# EAGLE design ram (EAGLE 9.5.0)
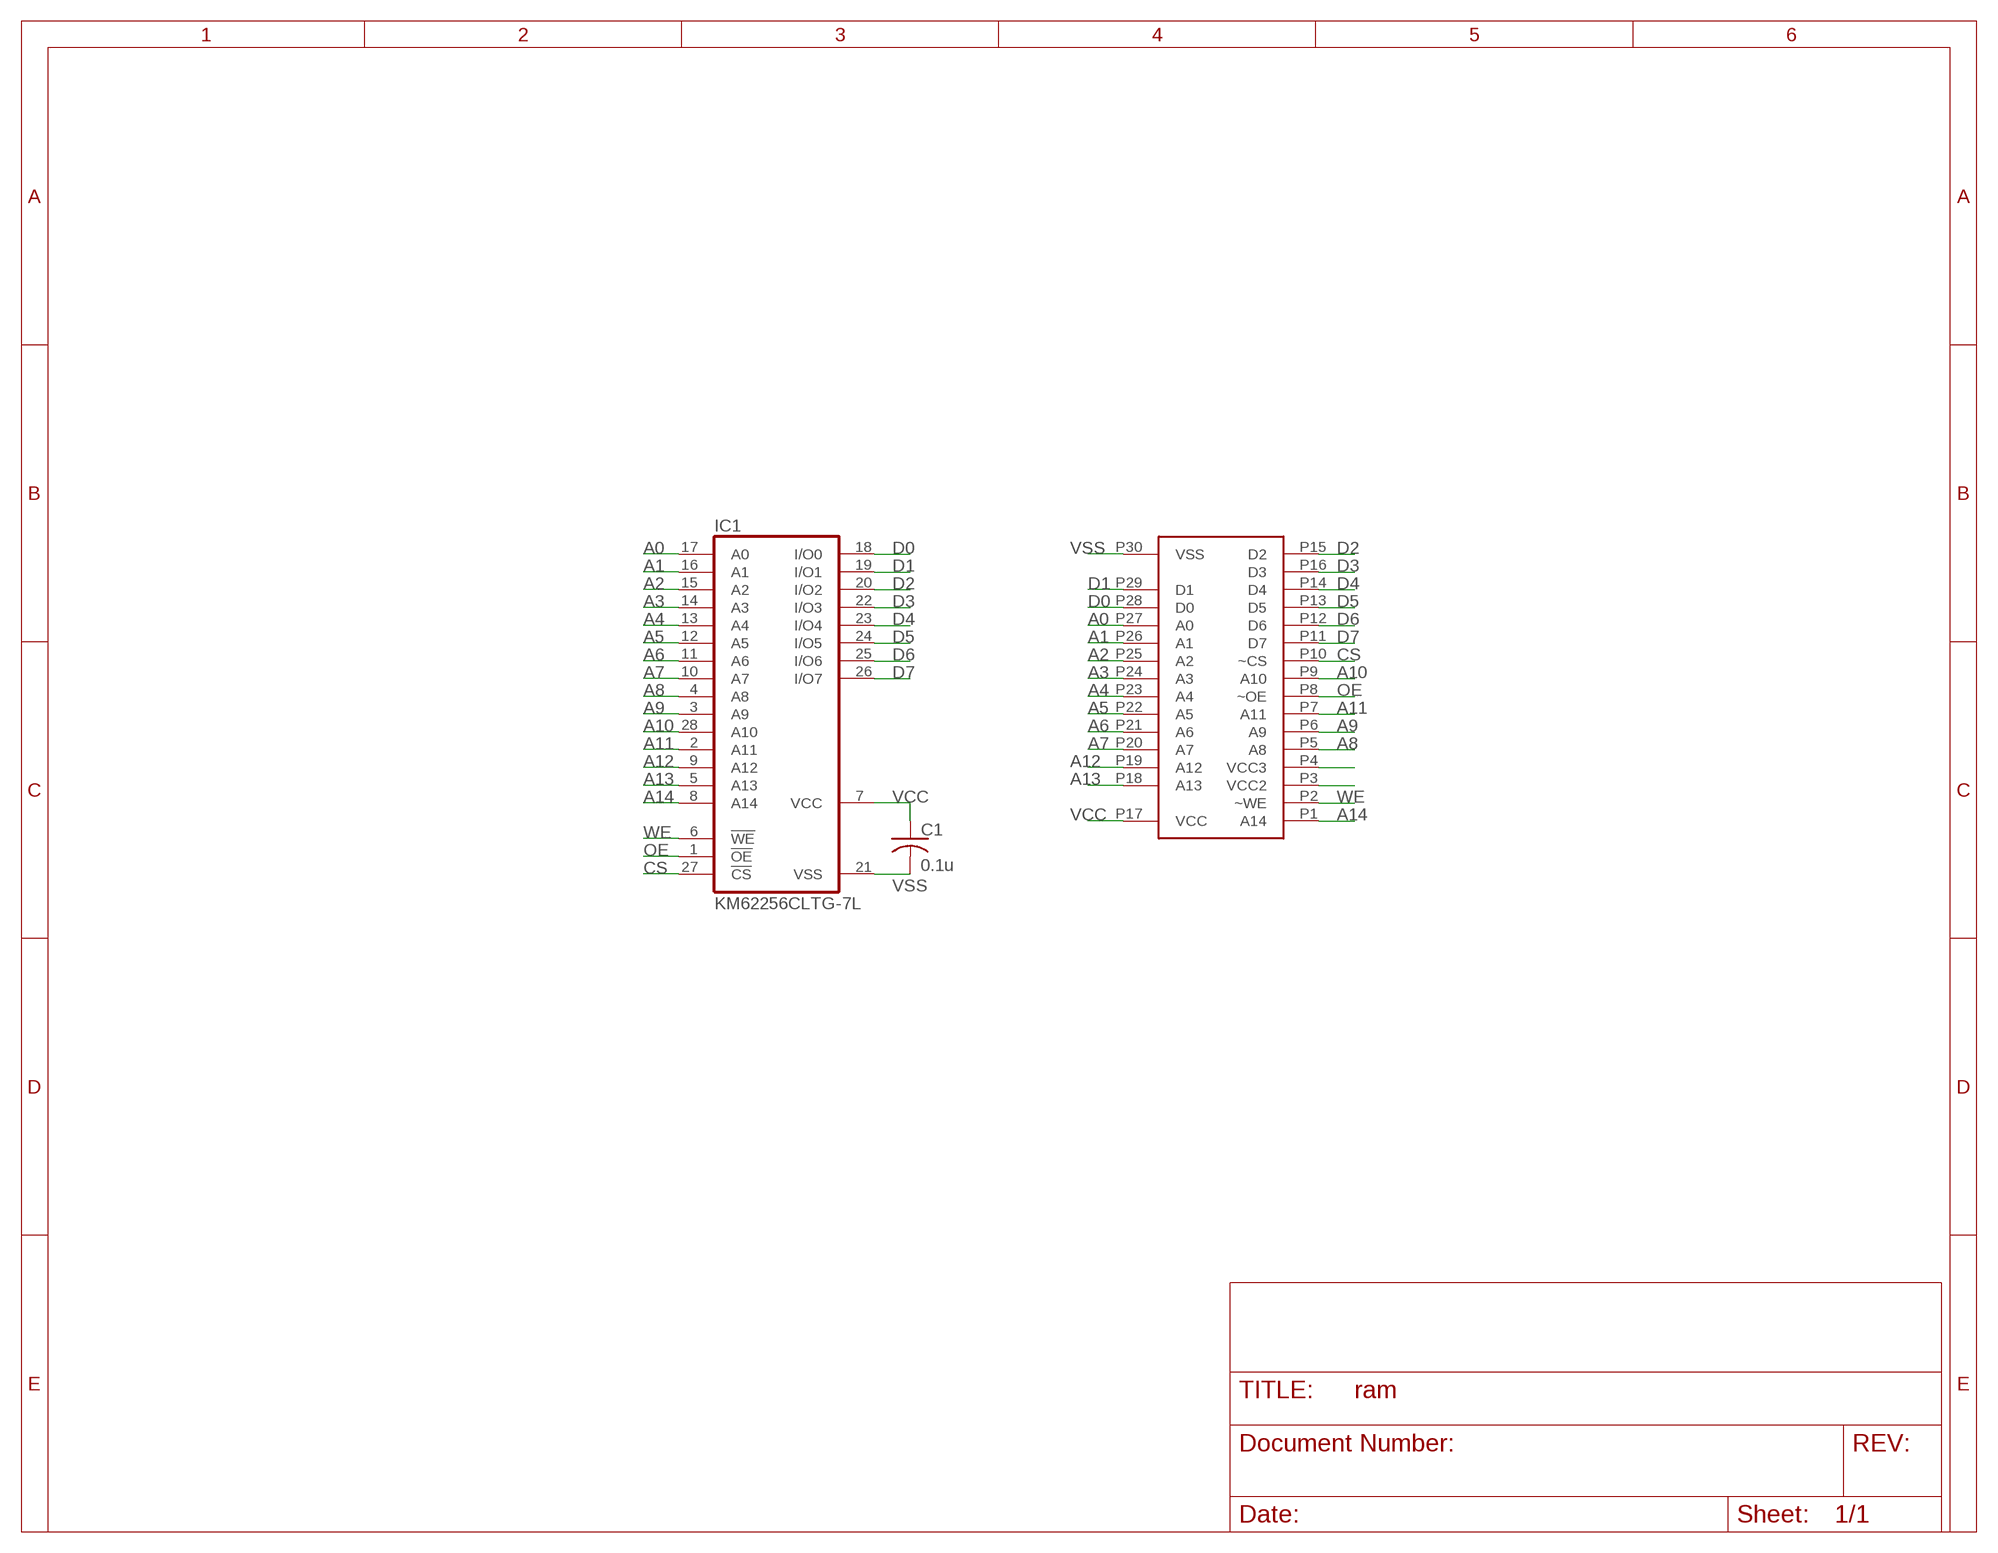
[diagram p0: schematic, sheet 1]

## Parts
C1  0.1u  C-USC0603  [C0603]
IC1  KM62256CLTG-7L  KM62256CLTG-7L_TSOP28F  [TSOP1-28]
U$1  RAMPORT  [CASIORAM]

## Nets
A0: IC1.17(A0) U$1.P27(A0)
A1: IC1.16(A1) U$1.P26(A1)
A2: IC1.15(A2) U$1.P25(A2)
A3: IC1.14(A3) U$1.P24(A3)
A4: IC1.13(A4) U$1.P23(A4)
A5: IC1.12(A5) U$1.P22(A5)
A6: IC1.11(A6) U$1.P21(A6)
A7: IC1.10(A7) U$1.P20(A7)
A8: IC1.4(A8) U$1.P5(A8)
A9: IC1.3(A9) U$1.P6(A9)
A10: IC1.28(A10) U$1.P9(A10)
A11: IC1.2(A11) U$1.P7(A11)
A12: IC1.9(A12) U$1.P19(A12)
A13: IC1.5(A13) U$1.P18(A13)
A14: IC1.8(A14) U$1.P1(A14)
CS: IC1.27(!CS) U$1.P10(~CS)
D0: IC1.18(I/O0) U$1.P28(D0)
D1: IC1.19(I/O1) U$1.P29(D1)
D2: IC1.20(I/O2) U$1.P15(D2)
D3: IC1.22(I/O3) U$1.P16(D3)
D4: IC1.23(I/O4) U$1.P14(D4)
D5: IC1.24(I/O5) U$1.P13(D5)
D6: IC1.25(I/O6) U$1.P12(D6)
D7: IC1.26(I/O7) U$1.P11(D7)
N$1: U$1.P4(VCC3)
N$2: U$1.P3(VCC2)
OE: IC1.1(!OE) U$1.P8(~OE)
VCC: C1.1 IC1.7(VCC) U$1.P17(VCC)
VSS: C1.2 IC1.21(VSS) U$1.P30(VSS)
WE: IC1.6(!WE) U$1.P2(~WE)

## Library data of the parts
C1 = rcl:C-US: CAPACITOR, American symbol; SPICEPREFIX: C
IC1 = memory-hitachi-hb:KM62256C: MEMORY
U$1 = RAM:RAMPORT

## Board
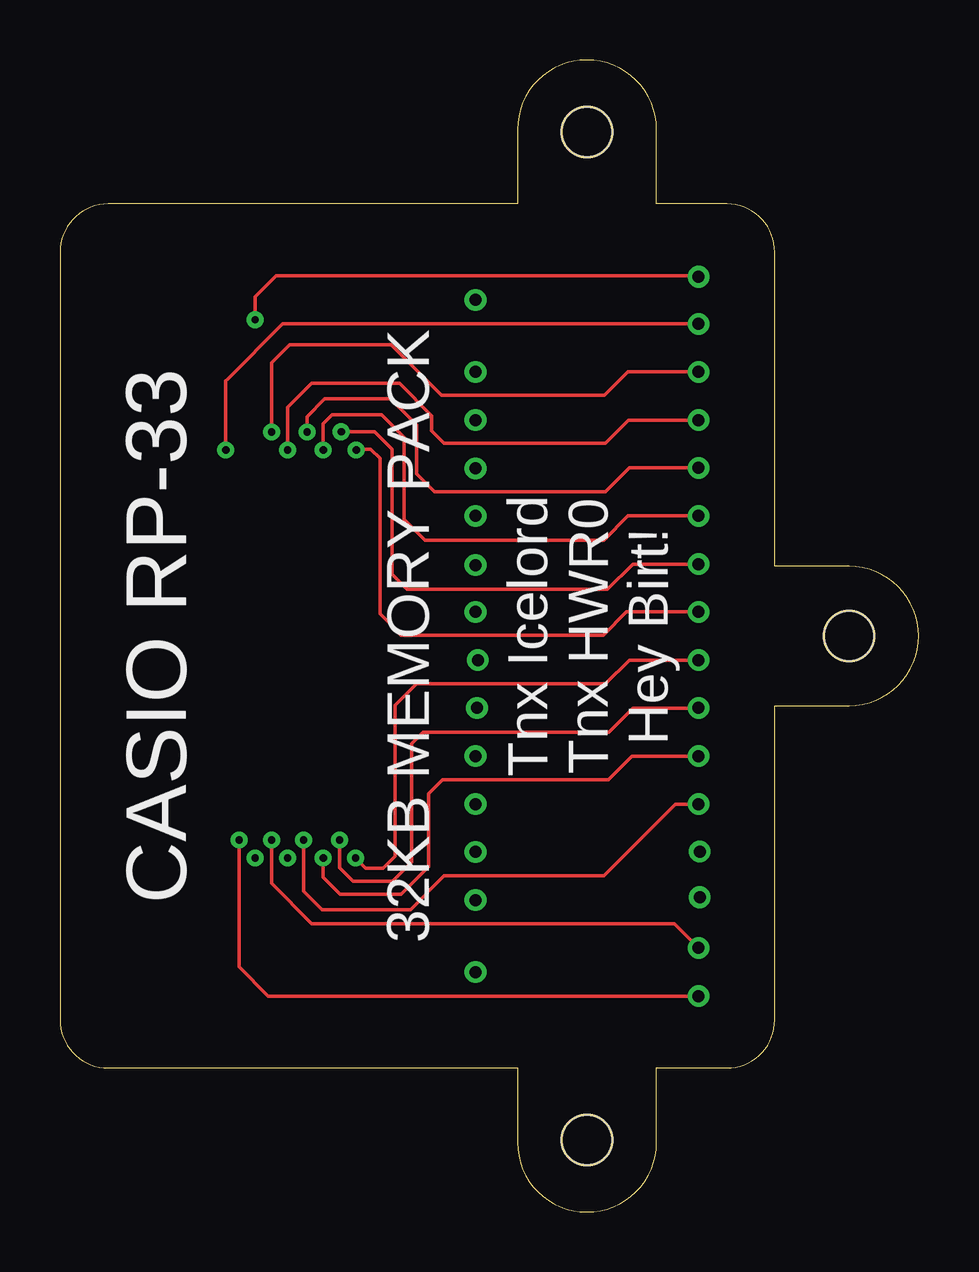
[diagram p1: board, top side]
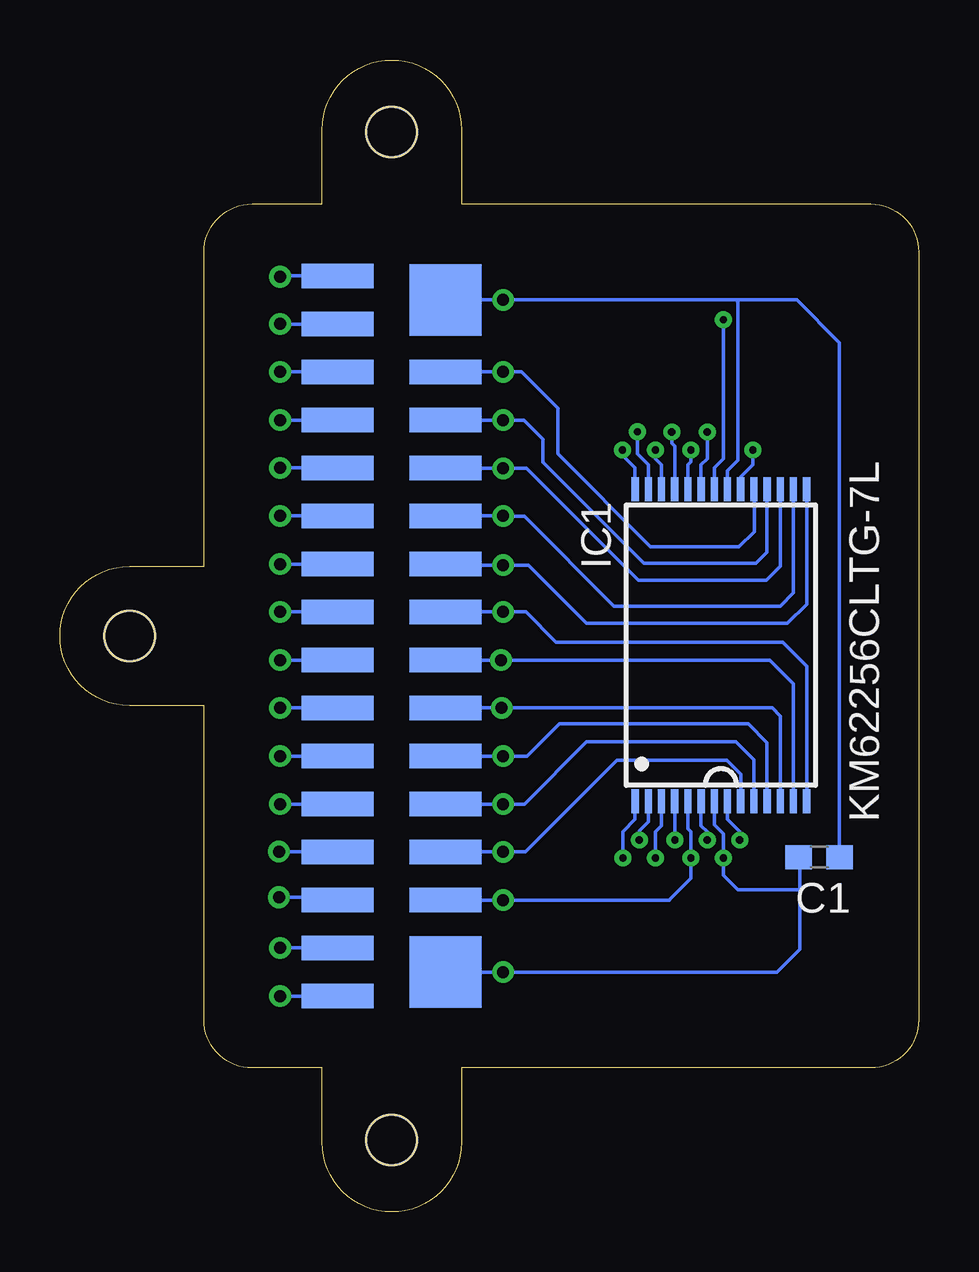
[diagram p2: board, bottom side, seen from below]

Size 35.8 x 48 mm. Coordinates in mm from the lower left corner, seen from the top.
Outline: 24.87,2.9 24.87,6 27.8,6 arc90 29.8,8 29.8,21.1 32.9,21.1 arc180 32.9,26.9 29.8,26.9 29.8,40 arc90 27.8,42 24.87,42 24.87,45.1 arc180 19.07,45.1 19.07,42 2,42 arc90 0,40 0,8 arc90 2,6 19.07,6 19.07,2.9 arc180 24.87,2.9
Outline: circle at 21.97,45 radius 1.05
Outline: circle at 21.97,3 radius 1.05
Outline: circle at 32.9,24 radius 1.05
Copper layers (1*16): Top 0.035mm / dielectric 1.5mm / Bottom 0.035mm
Design rules "default *": minimum track width 6mil, minimum drill 0.35mm, track to track 6mil, track to pad 6mil, pad to pad 6mil, via to via 6mil, smd to smd 6mil, copper to edge 40mil, drill to drill 6mil, minimum pad ring 10mil, minimum via ring 8mil, stop-mask expansion 4mil, vias tented up to drill 2mm, thermal gap 10mil
Holes 2.1 mm at 21.97,45 21.97,3 32.9,24

### Footprints (pad centres in the part's own frame; a part is rotated, then mirrored left to right if it is on the bottom)
C0603 = smd 1.1 x 1: 1 -0.85,0; 2 0.85,0
TSOP1-28 = smd 1 x 0.3: 1 -6.5,3.575; 2 -6.5,3.025; 3 -6.5,2.475; 4 -6.5,1.925; 5 -6.5,1.375; 6 -6.5,0.825; 7 -6.5,0.275; 8 -6.5,-0.275; 9 -6.5,-0.825; 10 -6.5,-1.375; 11 -6.5,-1.925; 12 -6.5,-2.475; 13 -6.5,-3.025; 14 -6.5,-3.575; 15 6.5,-3.575; 16 6.5,-3.025; 17 6.5,-2.475; 18 6.5,-1.925; 19 6.5,-1.375; 20 6.5,-0.825; 21 6.5,-0.275; 22 6.5,0.275; 23 6.5,0.825; 24 6.5,1.375; 25 6.5,1.925; 26 6.5,2.475; 27 6.5,3.025; 28 6.5,3.575
CASIORAM = smd 1.008 x 2.997 bottom: P1 -15.001,-2.25; P2 -13,-2.25; P3 -11.001,-2.25; P4 -8.999,-2.25; P5 -7,-2.25; P6 -5.001,-2.25; P7 -3,-2.25; P8 -1.001,-2.25; P9 1.001,-2.25; P10 3,-2.25; P11 5.001,-2.25; P12 7,-2.25; P13 8.999,-2.25; P14 11.001,-2.25; P15 13,-2.25; P16 15.001,-2.25; P18 -11.001,2.25; P19 -8.999,2.25; P20 -7,2.25; P21 -5.001,2.25; P22 -3,2.25; P23 -1.001,2.25; P24 1.001,2.25; P25 3,2.25; P26 5.001,2.25; P27 7,2.25; P28 8.999,2.25; P29 11.001,2.25 | smd 2.997 x 2.997 bottom: P17 -14,2.25; P30 14,2.25

### Placement (x,y rotation side)
C1  4.15,14.79 0 bottom
IC1  8.25,23.62 90 bottom
U$1  21.97,24 90 top

### Tracks (layer width: path | path; a pad name or v marks a point on that pad's centre or on a via)
A0  (via drill 0.5)
  Bottom 0.152: IC1.17 5.77,26.9 6.35,26.32 11.68,26.32 16.35,30.98 v17.32,30.98 19.7,30.98 U$1.P27
A1  (via drill 0.5)
  Bottom 0.152: IC1.16 5.22,25.8 5.78,25.24 12.7,25.24 16.45,28.99 17.37,28.99 v17.32,29 U$1.P26
A2  (via drill 0.5)
  Bottom 0.152: U$1.P25 19.68,26.95 v17.32,26.95 16.27,26.95 13.84,24.53 5.47,24.53 4.67,25.33 IC1.15
A3  (via drill 0.5)
  Bottom 0.152: U$1.P24 v17.32,25 16.38,25 15.11,23.73 5.67,23.73 4.67,22.74 IC1.14
A4  (via drill 0.5)
  Bottom 0.152: IC1.13 5.22,22.02 6.2,23 v17.42,23 U$1.P23
A5  (via drill 0.5)
  Bottom 0.152: IC1.12 5.77,20.66 6.11,21 v17.39,21 U$1.P22
A6  (via drill 0.5)
  Bottom 0.152: U$1.P21 v17.32,19 16.34,19 14.99,20.35 7.11,20.35 6.32,19.56 IC1.11
A7  (via drill 0.5)
  Bottom 0.152: IC1.10 6.87,18.84 7.62,19.59 13.84,19.59 16.43,17 v17.32,17 U$1.P20
A8  (via drill 0.3, 0.5)
  Top 0.152: v26.62,17 25.65,17 22.67,14.01 16.02,14.01 14.61,12.6 10.92,12.6 10.16,13.37 v10.16,15.5
  Bottom 0.152: U$1.P5 v26.62,17 | v10.16,15.5 10.16,17.11 IC1.4
A9  (via drill 0.3, 0.5)
  Top 0.152: v10.97,14.75 10.97,13.95 11.68,13.24 14.22,13.24 15.37,14.38 15.37,17.43 15.95,18.02 22.86,18.02 23.84,19 v26.62,19
  Bottom 0.152: U$1.P6 v26.62,19 | IC1.3 10.72,16.1 10.97,15.85 v10.97,14.75
A10  (via drill 0.3, 0.5)
  Top 0.152: v26.62,25 23.62,25 22.66,24.03 14.22,24.03 13.34,24.92 13.34,31.4 12.95,31.78 12.38,31.78 v12.35,31.75
  Bottom 0.152: U$1.P9 v26.62,25 | IC1.28 11.82,31.01 12.35,31.54 v12.35,31.75
A11  (via drill 0.3, 0.5)
  Top 0.152: v26.62,21 26.61,20.99 23.88,20.99 22.89,20 15.14,20 14.66,19.52 14.66,14.58 13.86,13.78 12.22,13.78 11.65,14.35 v11.65,15.5
  Bottom 0.152: U$1.P7 v26.62,21 | v11.65,15.5 11.65,15.88 11.27,16.26 IC1.2
A12  (via drill 0.5)
  Bottom 0.152: U$1.P19 v17.32,15 16.4,15 12.57,18.83 8,18.83 7.42,18.25 IC1.9
A13  (via drill 0.3, 0.5)
  Bottom 0.152: IC1.5 9.62,15.98 9.49,15.85 v9.49,14.75 9.49,13.9 10.35,13.05 10.4,13 v17.32,13 U$1.P18
A14  (via drill 0.3, 0.5)
  Top 0.152: v26.62,9 8.69,9 7.46,10.22 v7.46,15.5
  Bottom 0.152: U$1.P1 v26.62,9 | IC1.8 7.97,16.36 7.46,15.85 v7.46,15.5
CS  (via drill 0.3, 0.5)
  Top 0.152: v11.73,32.51 13.11,32.51 13.84,31.78 13.84,26.57 14.48,25.94 22.83,25.94 23.89,27 v26.62,27
  Bottom 0.152: U$1.P10 v26.62,27 | v11.73,32.51 11.73,31.59 11.27,31.13 IC1.27
D0  (via drill 0.5)
  Bottom 0.152: IC1.18 6.32,27.49 6.78,27.03 11.46,27.03 15.66,31.23 15.66,32.2 16.46,33 v17.32,33 U$1.P28
D1  (via drill 0.5)
  Bottom 0.152: U$1.P29 v17.32,35 16.55,35 15.05,33.49 15.05,31.59 11.18,27.72 7.49,27.72 6.86,28.35 6.86,30.11 IC1.19
D2  (via drill 0.3, 0.5)
  Top 0.152: v26.62,37 9.28,37 6.99,34.7 6.91,34.63 v6.91,31.75
  Bottom 0.152: v6.91,31.75 6.91,31.13 7.42,30.63 IC1.20 | U$1.P15 v26.62,37
D3  (via drill 0.3, 0.5)
  Top 0.152: v26.62,38.97 26.57,39.02 9.02,39.02 8.14,38.15 v8.14,37.18
  Bottom 0.152: IC1.22 8.52,31.01 8.14,31.39 v8.14,37.18 | U$1.P16 26.59,39 v26.62,38.97
D4  (via drill 0.3, 0.5)
  Top 0.152: v8.82,32.5 8.82,35.39 9.57,36.14 13.8,36.14 15.9,34.04 22.71,34.04 23.67,35 v26.62,35
  Bottom 0.152: U$1.P14 v26.62,35 | v8.82,32.5 8.82,31.39 9.07,31.13 IC1.23
D5  (via drill 0.3, 0.5)
  Top 0.152: v9.49,31.75 9.49,33.53 10.49,34.52 14.15,34.52 15.49,33.18 15.49,32.54 16,32.03 22.73,32.03 23.7,33 v26.62,33
  Bottom 0.152: U$1.P13 v26.62,33 | v9.49,31.75 9.49,31.26 9.62,31.13 IC1.24
D6  (via drill 0.3, 0.5)
  Top 0.152: v10.3,32.5 10.3,33.14 11.03,33.88 13.78,33.88 14.86,32.8 14.86,30.77 15.62,30 22.73,30 23.73,31 v26.62,31
  Bottom 0.152: U$1.P12 v26.62,31 | v10.3,32.5 10.3,32.02 10.17,31.9 IC1.25
D7  (via drill 0.3, 0.5)
  Top 0.152: v10.97,31.75 10.97,32.85 11.35,33.23 13.41,33.23 14.35,32.29 14.35,28.86 15.21,28 22.68,28 23.68,29 v26.62,29
  Bottom 0.152: v10.97,31.75 10.97,31.39 10.72,31.13 IC1.26 | v26.62,29 U$1.P11
N$1  (via drill 0.5)
  Bottom 0.152: U$1.P4 24.24,15.02 v26.67,15.02
N$2  (via drill 0.5)
  Bottom 0.152: U$1.P3 24.33,13.11 v26.67,13.11
OE  (via drill 0.3, 0.5)
  Top 0.152: v12.33,14.75 12.75,14.33 13.47,14.33 13.97,14.83 13.97,21.11 14.86,22 22.73,22 23.73,23 v26.62,23
  Bottom 0.152: U$1.P8 v26.62,23 | IC1.1 11.82,16.36 12.33,15.85 v12.33,14.75
VCC  (via drill 0.3, 0.5)
  Bottom 0.152: IC1.7 8.52,16.14 8.14,15.76 v8.14,14.75 8.14,14.03 7.54,13.43 5.01,13.43 4.95,13.49 | U$1.P17 v17.32,10 5.91,10 4.95,10.95 4.95,13.49 | 4.95,13.49 4.95,13.62 4.95,14.74 C1.1
VSS  (via drill 0.5)
  Bottom 0.152: IC1.21 7.97,30.88 7.54,31.32 7.54,37.92 7.62,38 | U$1.P30 v17.32,38 7.62,38 | 7.62,38 5.08,38 3.3,36.23 C1.2
WE  (via drill 0.3, 0.5)
  Top 0.152: v26.62,11 25.61,12.02 10.49,12.02 8.82,13.69 v8.82,15.5
  Bottom 0.152: U$1.P2 v26.62,11 | IC1.6 9.07,16.1 8.82,15.85 v8.82,15.5

### Text on the board
tNames: CASIO RP-33 | 32KB MEMORY PACK | Tnx Icelord / Tnx HWR0 / Hey Birt!